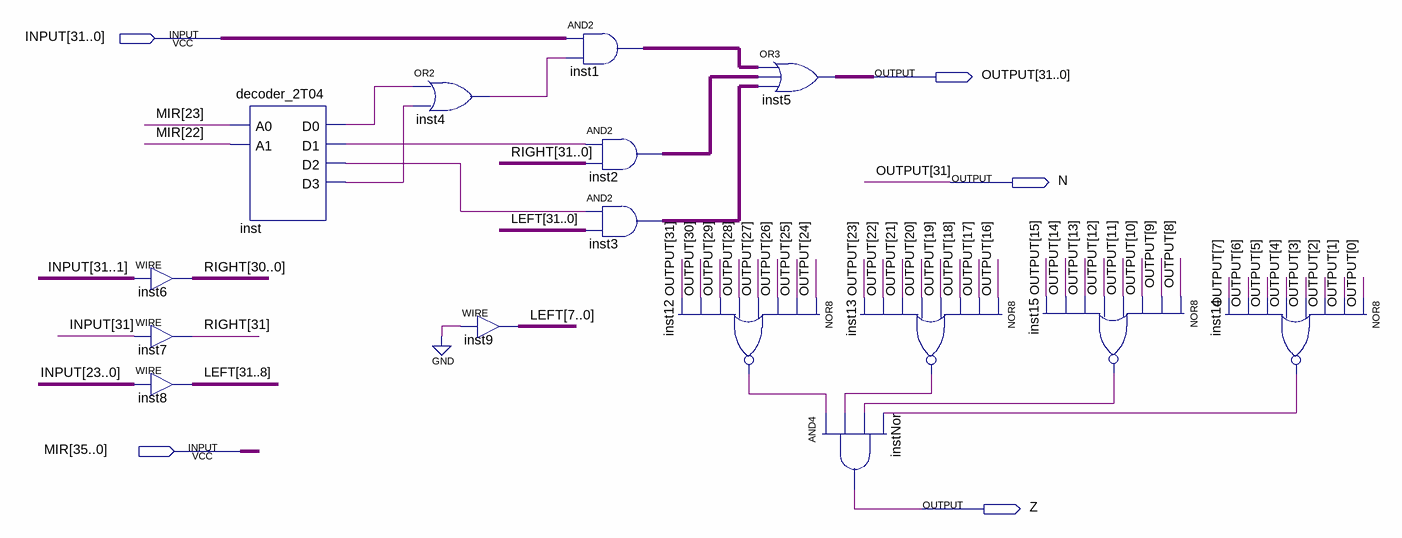
[diagram p0: schematic sheet]
// Quartus schematic SHIFTER.bdf as structural Verilog: 15 symbols, 5 pins
module SHIFTER (
  input  [31:0] INPUT,
  input  [35:0] MIR,
  output [31:0] OUTPUT,
  output N,
  output Z
);

  wire inst4_out, inst12_out, inst13_out, inst14_out, inst15_out, inst_d0, inst_d1, inst_d2, inst_d3;
  wire [31:0] inst1_out, inst2_out, inst3_out, LEFT, RIGHT;

  assign RIGHT[30:0] = INPUT[31:1];  // WIRE inst6
  assign RIGHT[31] = INPUT[31];  // WIRE inst7
  assign LEFT[31:8] = INPUT[23:0];  // WIRE inst8
  decoder_2T04 inst (.A0(MIR[23]), .A1(MIR[22]), .D0(inst_d0), .D1(inst_d1), .D2(inst_d2), .D3(inst_d3));
  or inst4 (inst4_out, inst_d0, inst_d3);
  assign LEFT[7:0] = {8{1'b0}};  // WIRE inst9
  assign inst1_out = INPUT & {32{inst4_out}};  // AND2 inst1, 32 bits wide
  assign inst2_out = {32{inst_d1}} & RIGHT;  // AND2 inst2, 32 bits wide
  assign inst3_out = {32{inst_d2}} & LEFT;  // AND2 inst3, 32 bits wide
  nor inst12 (inst12_out, OUTPUT[24], OUTPUT[25], OUTPUT[26], OUTPUT[27], OUTPUT[28], OUTPUT[29], OUTPUT[30], N);
  assign {N, OUTPUT[30:0]} = inst1_out | inst2_out | inst3_out;  // OR3 inst5, 32 bits wide
  and instNor (Z, inst12_out, inst13_out, inst15_out, inst14_out);
  nor inst13 (inst13_out, OUTPUT[16], OUTPUT[17], OUTPUT[18], OUTPUT[19], OUTPUT[20], OUTPUT[21], OUTPUT[22], OUTPUT[23]);
  nor inst15 (inst15_out, OUTPUT[8], OUTPUT[9], OUTPUT[10], OUTPUT[11], OUTPUT[12], OUTPUT[13], OUTPUT[14], OUTPUT[15]);
  nor inst14 (inst14_out, OUTPUT[0], OUTPUT[1], OUTPUT[2], OUTPUT[3], OUTPUT[4], OUTPUT[5], OUTPUT[6], OUTPUT[7]);

  assign OUTPUT[31] = N;
endmodule
